# Altium schematic sheet contactor_connectors.SchDoc: foxBMS BMS-Extension
size A3; DocumentNumber: 6; SheetNumber: 6; SheetTotal: 14; Author: Fraunhofer IISB foxBMS Team; REL-DATE: 2017-05-16; VERSION: 1.0.2; GateName_1: G$1; SymbolName_1: FRAME_B_L; LibraryName: foxBMS_BMS-Master_V1.00_A; DeviceSetName: FRAME_B_L; GateName_2: G$2; SymbolName_2: DOCFIELD; SheetDescription: Contactor Connectors
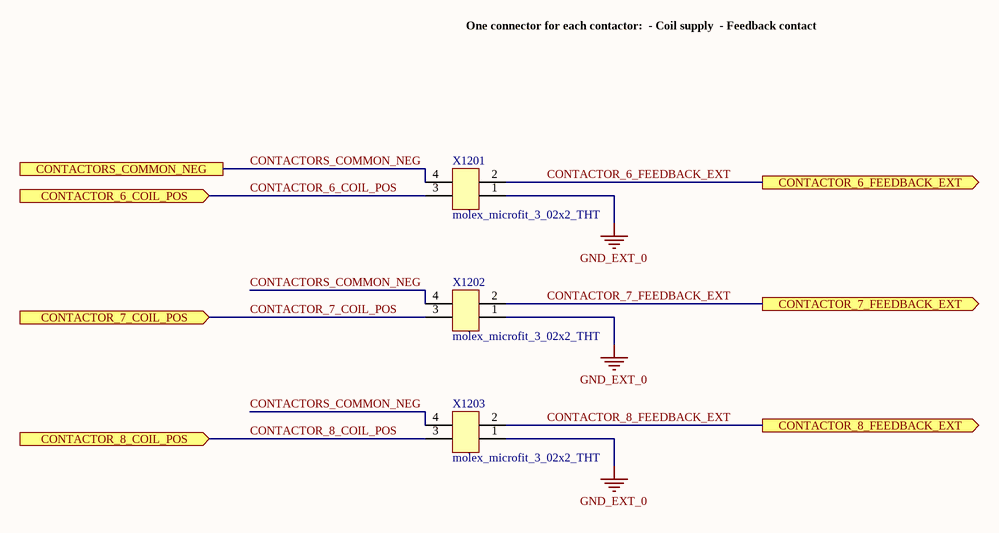
[diagram p0: contactor_connectors.SchDoc]

## Parts
X1201  molex_microfit_3_02x2_THT  [43045-0421]
X1202  molex_microfit_3_02x2_THT  [43045-0421]
X1203  molex_microfit_3_02x2_THT  [43045-0421]

## Ports
CONTACTOR_6_COIL_POS (in), CONTACTOR_6_FEEDBACK_EXT (out), CONTACTOR_7_COIL_POS (in), CONTACTOR_7_FEEDBACK_EXT (out), CONTACTOR_8_COIL_POS (in), CONTACTOR_8_FEEDBACK_EXT (out), CONTACTORS_COMMON_NEG

## Nets
GND_EXT_0: X1201.1 X1202.1 X1203.1
CONTACTOR_6_COIL_POS: X1201.3 ; port CONTACTOR_6_COIL_POS
CONTACTOR_6_FEEDBACK_EXT: X1201.2 ; port CONTACTOR_6_FEEDBACK_EXT
CONTACTOR_7_COIL_POS: X1202.3 ; port CONTACTOR_7_COIL_POS
CONTACTOR_7_FEEDBACK_EXT: X1202.2 ; port CONTACTOR_7_FEEDBACK_EXT
CONTACTOR_8_COIL_POS: X1203.3 ; port CONTACTOR_8_COIL_POS
CONTACTOR_8_FEEDBACK_EXT: X1203.2 ; port CONTACTOR_8_FEEDBACK_EXT
CONTACTORS_COMMON_NEG: X1201.4 X1202.4 X1203.4 ; port CONTACTORS_COMMON_NEG

## Notes on the sheet
- One connector for each contactor:
  - Coil supply
  - Feedback contact
- Fraunhofer IISB
- Schottkystr. 10
- developed by:
- 91058 Erlangen
- Germany
- Author
- Project
- License
- Description
- File
- Version
- Release Date
- Sheet
- www.foxbms.org
- www.iisb.fraunhofer.de
- foxBMS Team
- /

## Library data of the parts
X1201-X1203 = molex_microfit_3_02x2_THT: Micro-Fit 3.0 Right Angle Header, 3.00mm Pitch, Dual Row, 4 Circuits, with Snap-in Plastic Peg PCB Lock, Tin, Glow Wire Capable, Black, 43045-0400; Manufacturer: Molex; Circuits: 4; Rated Voltage: 600V; Rated Current: 8.5A; Part Number: molex_microfit_3_02x2_THT; Part Name: MicroFit; Operating Temperature: -40°C - +105°C; Supplier 1: Farnell; Supplier Part Number 1: 9733019